# Altium schematic sheet memory module.SchDoc: Memory Module (MEM)
size A4; Date: 2014-12-21; Author: Artur Scholz; DocumentNumber: LibreCube LC23-01a
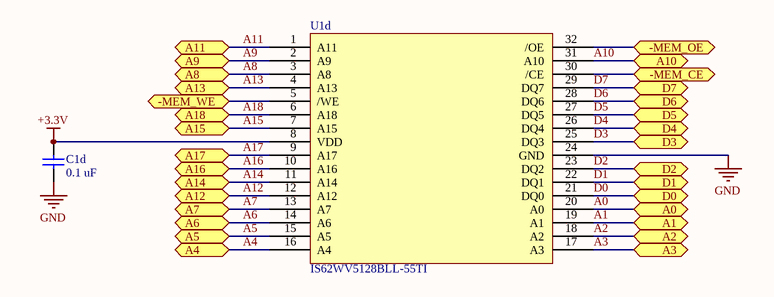
[diagram p0: memory module.SchDoc]

## Parts
C1d  0.1 uF  [0603]
U1d  IS62WV5128BLL-55TI  [TSOP-32]

## Ports
-MEM_CE, -MEM_OE, -MEM_WE, A0, A1, A2, A3, A4, A5, A6, A7, A8, A9, A10, A11, A12, A13, A14, A15, A16, A17, A18, D0, D1, D2, D3, D4, D5, D6, D7

## Nets
+3.3V: C1d.2 U1d.8(VDD)
GND: C1d.1 U1d.24(GND)
-MEM_CE: U1d.30(/CE) ; port -MEM_CE
-MEM_OE: U1d.32(/OE) ; port -MEM_OE
-MEM_WE: U1d.5(/WE) ; port -MEM_WE
A0: U1d.20(A0) ; port A0
A1: U1d.19(A1) ; port A1
A2: U1d.18(A2) ; port A2
A3: U1d.17(A3) ; port A3
A4: U1d.16(A4) ; port A4
A5: U1d.15(A5) ; port A5
A6: U1d.14(A6) ; port A6
A7: U1d.13(A7) ; port A7
A8: U1d.3(A8) ; port A8
A9: U1d.2(A9) ; port A9
A10: U1d.31(A10) ; port A10
A11: U1d.1(A11) ; port A11
A12: U1d.12(A12) ; port A12
A13: U1d.4(A13) ; port A13
A14: U1d.11(A14) ; port A14
A15: U1d.7(A15) ; port A15
A16: U1d.10(A16) ; port A16
A17: U1d.9(A17) ; port A17
A18: U1d.6(A18) ; port A18
D0: U1d.21(DQ0) ; port D0
D1: U1d.22(DQ1) ; port D1
D2: U1d.23(DQ2) ; port D2
D3: U1d.25(DQ3) ; port D3
D4: U1d.26(DQ4) ; port D4
D5: U1d.27(DQ5) ; port D5
D6: U1d.28(DQ6) ; port D6
D7: U1d.29(DQ7) ; port D7

## Library data of the parts
C1d = Cap